# EAGLE design BeagleQ-v31 (EAGLE 7.1.0)
BOARD_NUMBER: 1.0
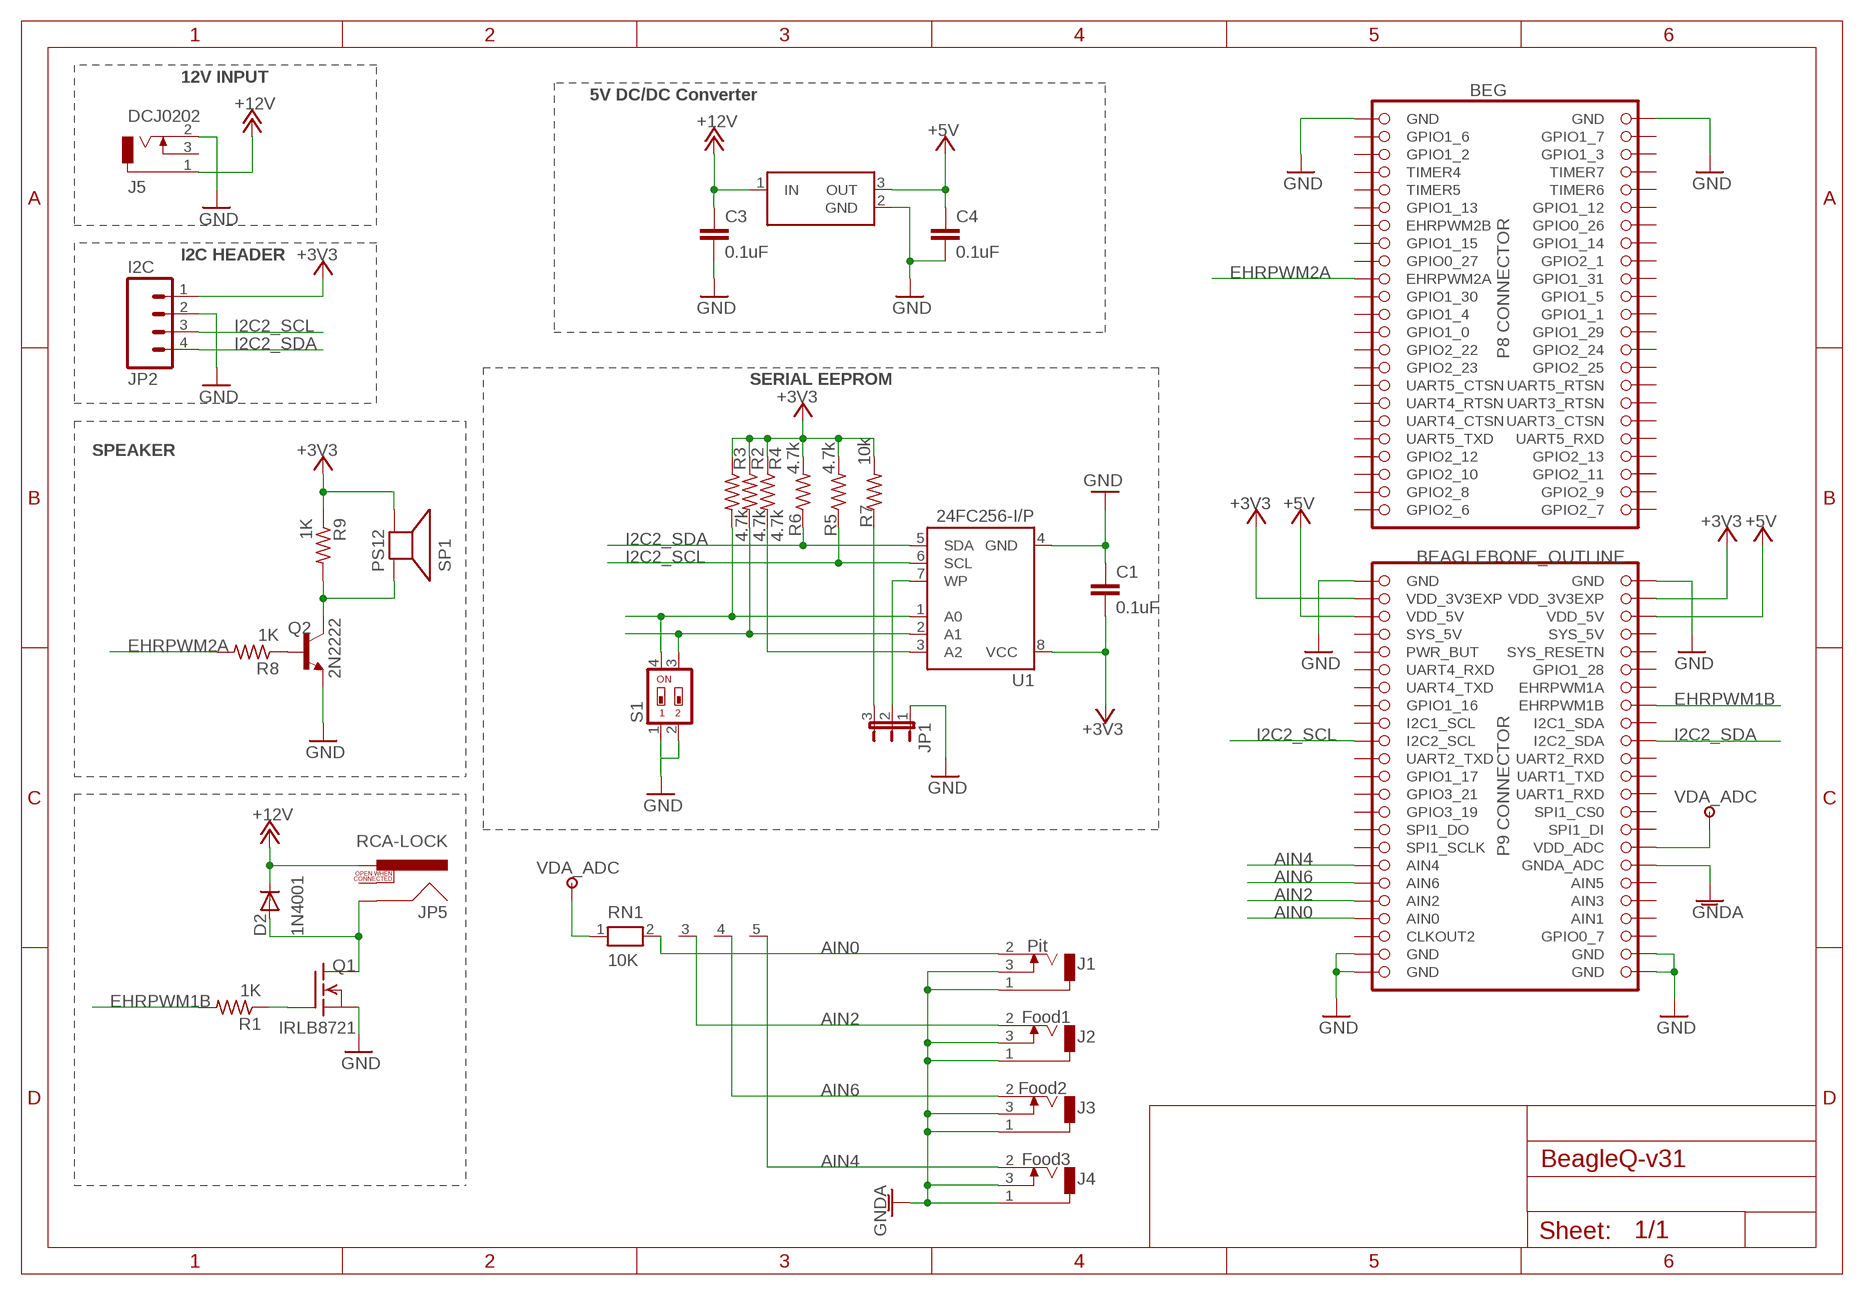
[diagram p0: schematic, sheet 1]

## Parts
BEG  BEAGLEBONE_OUTLINE  [BEAGLEBONE_SHIELD]
C1  0.1uF  C2.5/2  [C2.5-2]
C3  0.1uF  C2.5/2  [C2.5-2]
C4  0.1uF  C2.5/2  [C2.5-2]
D2  1N4001  1N4004  [DO41-10]
J1  Pit  MJ-2508N  [MJ-2508N]
J2  Food1  MJ-2508N  [MJ-2508N]
J3  Food2  MJ-2508N  [MJ-2508N]
J4  Food3  MJ-2508N  [MJ-2508N]
J5  DCJ0202  [DCJ0202]
JP1  WP  JP2E  [JP2]
JP2  I2C  M04PTH  [1X04]
JP5  RCA-LOCK  [RCA_LOCK]
Q1  IRLB8721  BUZ10  [TO220]
Q2  2N2222  [TO-92]
R1  1K  R-US_0207/10  [0207/10]
R2  4.7k  R-US_0207/10  [0207/10]
R3  4.7k  R-US_0207/10  [0207/10]
R4  4.7k  R-US_0207/10  [0207/10]
R5  4.7k  R-US_0207/10  [0207/10]
R6  4.7k  R-US_0207/10  [0207/10]
R7  10k  R-US_0207/10  [0207/10]
R8  1K  R-US_0207/10  [0207/10]
R9  1K  R-US_0207/10  [0207/10]
RN1  10K  RN04  [RN-5]
S1  SWS002  [SMS-002]
SP1  PS12  SPEAKER/PS12  [PS12]
U1  24FC256-I/P  AT24CP  [DIL08]
U2  OKI-78SRHZNTL  [OKI-78SR-HZNTL]

## Nets
+3V3: BEG.49(VDD_3V3EXP) BEG.50(VDD_3V3EXP) C1.2 JP2.1 R2.1 R3.1 R4.1 R5.2 R6.2 R7.2 R9.1 SP1.P$2(-) U1.8(VCC)
+5V [VDD]: BEG.51(VDD_5V) BEG.52(VDD_5V) C4.1 U2.3(OUT)
+12V: C3.1 D2.C J5.1 JP5.PIN U2.1(IN)
AIN0: BEG.85(AIN0) J1.2 RN1.2
AIN2: BEG.83(AIN2) J2.2 RN1.3
AIN4: BEG.79(AIN4) J4.2 RN1.5
AIN6: BEG.81(AIN6) J3.2 RN1.4
BLOWER_L [VCC_12V]: D2.A JP5.SHELL Q1.2(D)
EHRPWM1B: BEG.62(EHRPWM1B) R1.2
EHRPWM2A: BEG.19(EHRPWM2A) R8.2
GND [GND]: BEG.1(GND) BEG.2(GND) BEG.47(GND) BEG.48(GND) BEG.89(GND) BEG.90(GND) BEG.91(GND) BEG.92(GND) C1.1 C3.2 C4.2 J5.2 JP1.1 JP2.2 Q1.3(S) Q1.4(S) Q2.1(E) S1.1 S1.2 U1.4(GND) U2.2(GND)
GNDA: BEG.80(GNDA_ADC) J1.1 J1.3 J2.1 J2.3 J3.1 J3.3 J4.1 J4.3
I2C2_SCL: BEG.65(I2C2_SCL) JP2.3 R5.1 U1.6(SCL)
I2C2_SDA: BEG.66(I2C2_SDA) JP2.4 R6.1 U1.5(SDA)
N$1: R2.2 S1.3 U1.2(A1)
N$2: R3.2 S1.4 U1.1(A0)
N$3: JP1.2 U1.7(WP)
N$4: Q1.1(G) R1.1
N$5: JP1.3 R7.1
N$9: R4.2 U1.3(A2)
N$12: Q2.2(B) R8.1
N$13: Q2.3(C) R9.2 SP1.P$1(+)
VDA_ADC: BEG.78(VDD_ADC) RN1.1
Unconnected: BEG.3(GPIO1_6) BEG.4(GPIO1_7) BEG.5(GPIO1_2) BEG.6(GPIO1_3) BEG.7(TIMER4) BEG.8(TIMER7) BEG.9(TIMER5) BEG.10(TIMER6) BEG.11(GPIO1_13) BEG.12(GPIO1_12) BEG.13(EHRPWM2B) BEG.14(GPIO0_26) BEG.15(GPIO1_15) BEG.16(GPIO1_14) BEG.17(GPIO0_27) BEG.18(GPIO2_1) BEG.20(GPIO1_31) BEG.21(GPIO1_30) BEG.22(GPIO1_5) BEG.23(GPIO1_4) BEG.24(GPIO1_1) BEG.25(GPIO1_0) BEG.26(GPIO1_29) BEG.27(GPIO2_22) BEG.28(GPIO2_24) BEG.29(GPIO2_23) BEG.30(GPIO2_25) BEG.31(UART5_CTSN) BEG.32(UART5_RTSN) BEG.33(UART4_RTSN) BEG.34(UART3_RTSN) BEG.35(UART4_CTSN) BEG.36(UART3_CTSN) BEG.37(UART5_TXD) BEG.38(UART5_RXD) BEG.39(GPIO2_12) BEG.40(GPIO2_13) BEG.41(GPIO2_10) BEG.42(GPIO2_11) BEG.43(GPIO2_8) BEG.44(GPIO2_9) BEG.45(GPIO2_6) BEG.46(GPIO2_7) BEG.54(SYS_5V) BEG.55(PWR_BUT) BEG.56(SYS_RESETN) BEG.57(UART4_RXD) BEG.58(GPIO1_28) BEG.59(UART4_TXD) BEG.60(EHRPWM1A) BEG.61(GPIO1_16) BEG.63(I2C1_SCL) BEG.64(I2C1_SDA) BEG.67(UART2_TXD) BEG.68(UART2_RXD) BEG.69(GPIO1_17) BEG.70(UART1_TXD) BEG.71(GPIO3_21) BEG.72(UART1_RXD) BEG.73(GPIO3_19) BEG.74(SPI1_CS0) BEG.75(SPI1_DO) BEG.76(SPI1_DI) BEG.77(SPI1_SCLK) BEG.82(AIN5) BEG.84(AIN3) BEG.86(AIN1) BEG.87(CLKOUT2) BEG.88(GPIO0_7) J5.3 JP5.SWITCH

## Notes on the sheet
- 12V INPUT
- 5V DC/DC Converter
- I2C HEADER
- SERIAL EEPROM
- SPEAKER

## Power pins joined to a net without a drawn wire
SYS_5V: BEG.53(SYS_5V)

## Library data of the parts
BEG = BeagleQ-v03:BEAGLEBONE_OUTLINE: Should match A3 pinout - but not completely tested
C1 C3 C4 = capacitor-wima:C: CAPACITOR naming: grid - package width
D2 = BeagleQ-v03:1N4004: DIODE General purpose 1N400x type rectifier (With bigger pads) http://www.ladyada.net/library/pcb/eaglelibrary.html
J1-J4 = BeagleQ-v03:MJ-2508N
J5 = BeagleQ-v03:DCJ0202: DC POWER JACK Source: DCJ0202.pdf; OC_FARNELL: unknown; OC_NEWARK: unknown
JP1 = jumper:JP2E: JUMPER
JP2 = SparkFun-Connectors:M04: Header 4 Standard 4-pin 0.1" header. Use with straight break away headers (SKU : PRT-00116), right angle break away headers (PRT-00553), swiss pins (PRT-00743), machine pins (PRT-00117), and female headers (PRT-00115). Molex polarized connector foot print use with SKU : PRT-08231 with associated crimp pins and housings. 1MM SMD Version SKU: PRT-10208
JP5 = BeagleQ-v03:RCA
Q1 = BeagleQ-v03:BUZ10: N-Channel Enhancement MOSFET 50V; 20A; 0,080Ohm
Q2 = BeagleQ-v03:2N2222*: NPN Transistor
R1 R8 R9 = BeagleQ-v03:R-US_: RESISTOR, American symbol
R2-R7 = resistor:R-US_: RESISTOR, American symbol
RN1 = BeagleQ-v03:RN04: RESISTOR NETWORK; OC_FARNELL: unknown; OC_NEWARK: unknown
S1 = BeagleQ-v03:SWS002: SMD Dip Switch 2 pol.
SP1 = adafruit:SPEAKER: SPEAKER Source: Buerklin Added PS12 (for part # PS1240 piezo) http://www.ladyada.net/library/pcb/eaglelibrary.html
U1 = BeagleQ-v03:AT24C*: 2-wire serial EEPROM; MPN: AT24C1024BW-SH-B; OC_FARNELL: 1362646; OC_NEWARK: 03P2044
U2 = BeagleQ-v03:OKI-78SR

## Net classes
0 default: width 0.203 mm
1 VCC_12V: width 0.305 mm, drill 0.406 mm
2 VDD: width 0.305 mm, drill 0.406 mm
3 GND: width 0.254 mm, drill 0.406 mm

## Board
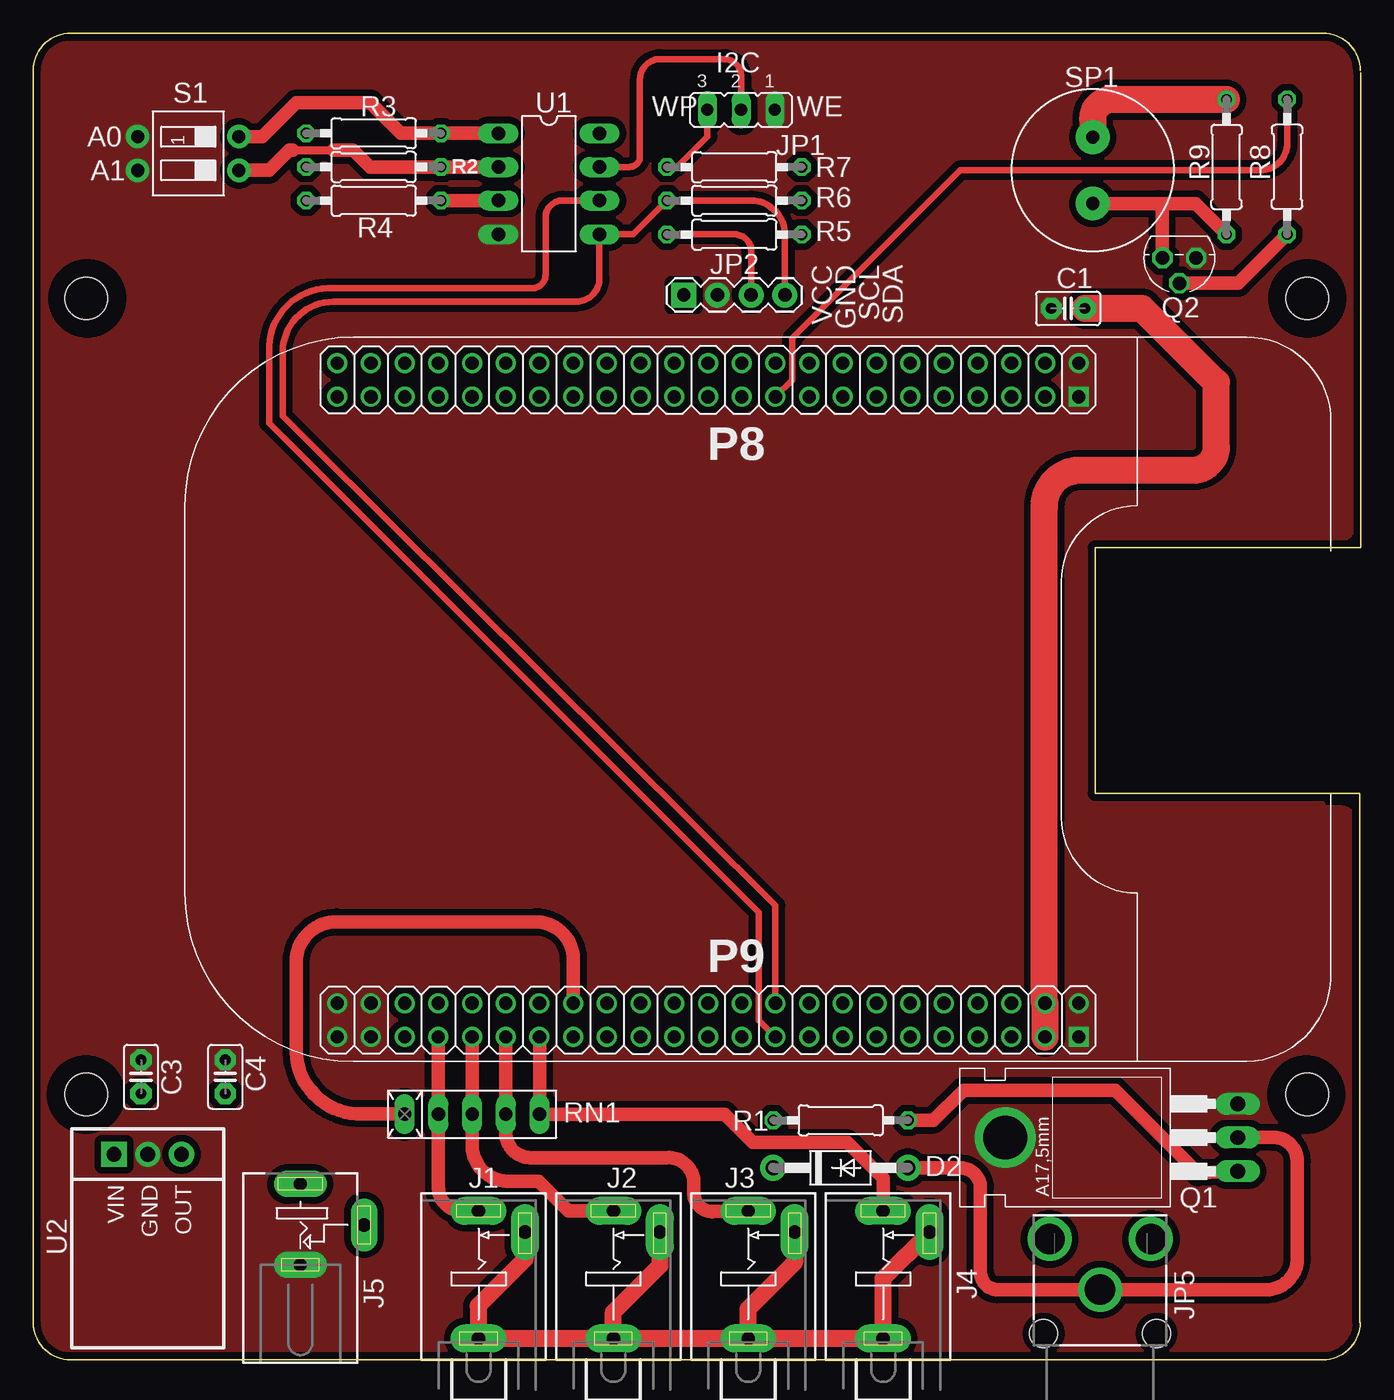
[diagram p1: board, top side]
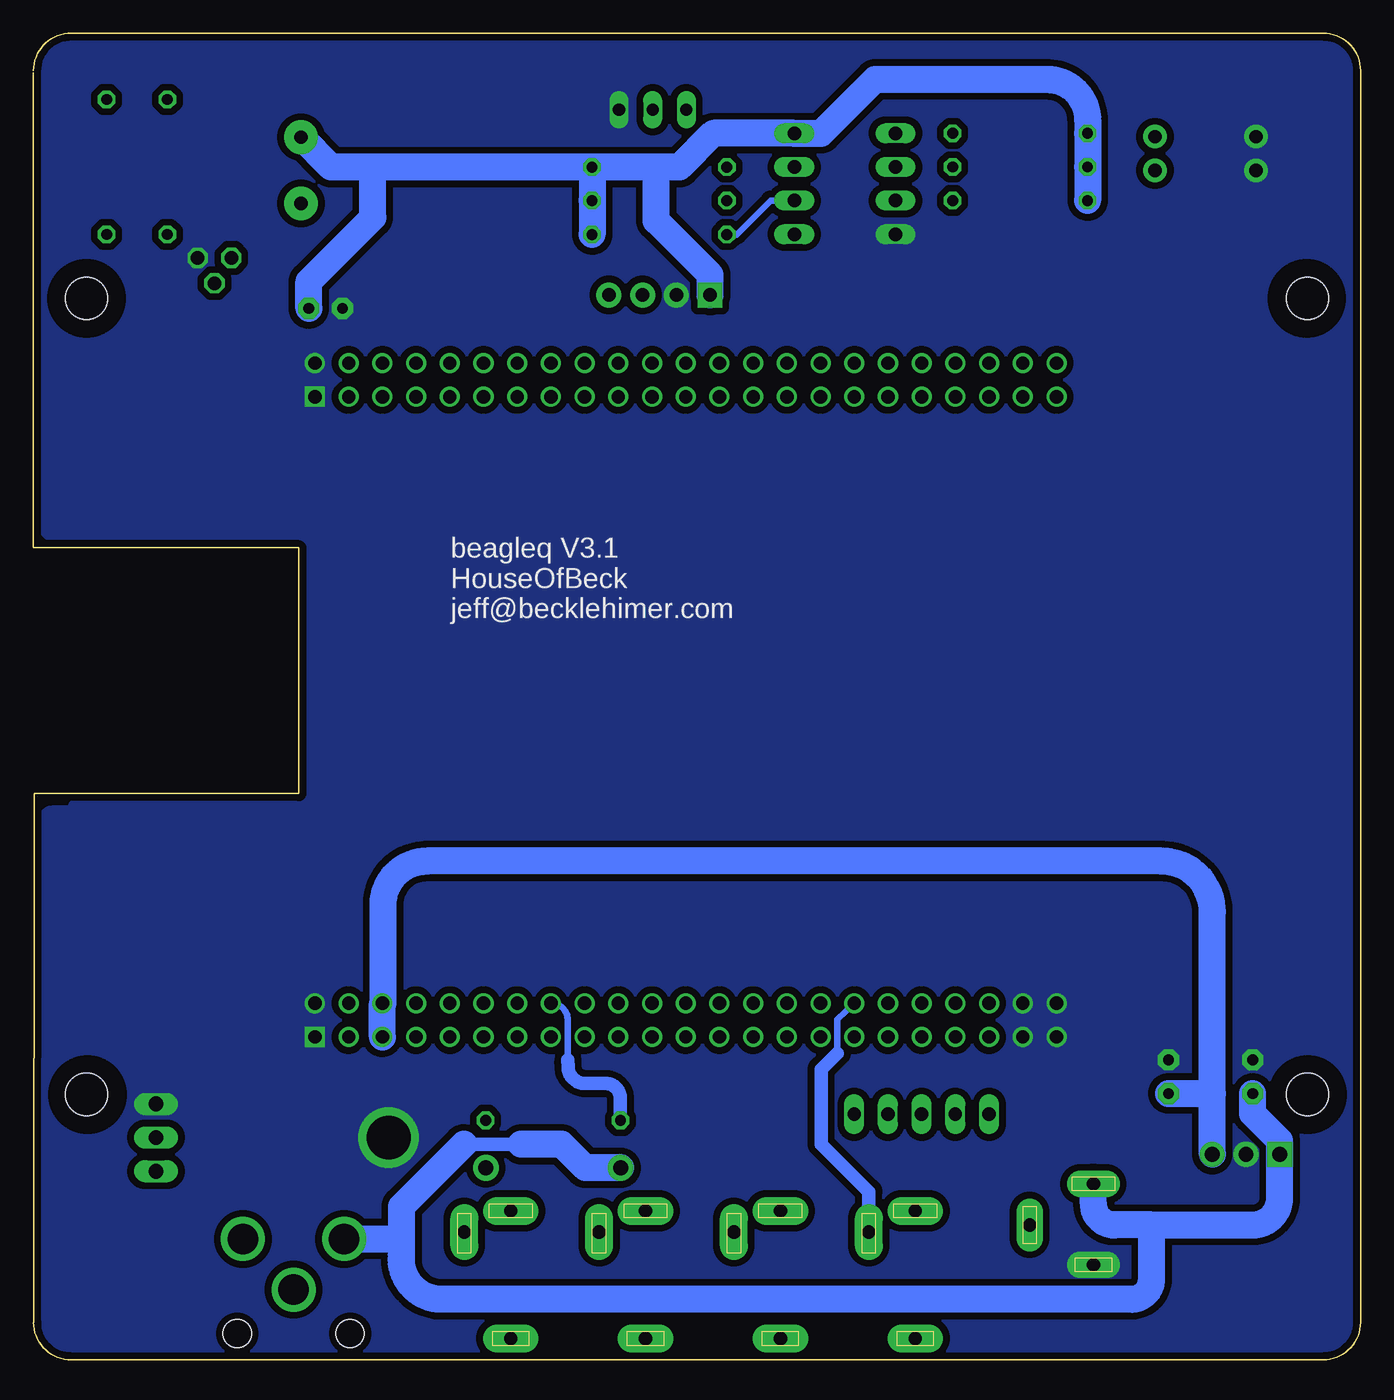
[diagram p2: board, bottom side, seen from below]

Size 100.02 x 100 mm. Coordinates in mm from the lower left corner, seen from the top.
Copper layers 1*16: Top 0.035mm / dielectric 1.5mm / Bottom 0.035mm
Design rules "dirt_cheap_dirty_boards.v1 *": minimum track width 5mil, minimum drill 12mil, track to track 10mil, track to pad 10mil, pad to pad 10mil, via to via 10mil, smd to smd 0mil, copper to edge 20mil, drill to drill 20mil, minimum pad ring 10mil, minimum via ring 6mil, stop-mask expansion 2mil, vias tented up to drill 25mil, thermal gap 10mil
tRestrict: area 93.8,77.8 to 98.2,82.2; area 1.9,77.8 to 6.2,82.2; area 1.8,17.8 to 6.2,22.2; area 93.8,17.8 to 98.1,22.2
bRestrict: area 93.8,77.8 to 98.2,82.2; area 1.9,77.8 to 6.2,82.2; area 1.8,17.8 to 6.2,22.2; area 93.8,17.8 to 98.1,22.2

### Footprints (pad centres in the part's own frame; a part is rotated, then mirrored left to right if it is on the bottom)
BEAGLEBONE_SHIELD = drill 1 square: 1 78.79,72.595; 47 78.79,24.335 | drill 1: 2 78.79,75.135; 3 76.25,72.595; 4 76.25,75.135; 5 73.71,72.595; 6 73.71,75.135; 7 71.17,72.595; 8 71.17,75.135; 9 68.63,72.595; 10 68.63,75.135; 11 66.09,72.595; 12 66.09,75.135; 13 63.55,72.595; 14 63.55,75.135; 15 61.01,72.595; 16 61.01,75.135; 17 58.47,72.595; 18 58.47,75.135; 19 55.93,72.595; 20 55.93,75.135; 21 53.39,72.595; 22 53.39,75.135; 23 50.85,72.595; 24 50.85,75.135; 25 48.31,72.595; 26 48.31,75.135; 27 45.77,72.595; 28 45.77,75.135; 29 43.23,72.595; 30 43.23,75.135; 31 40.69,72.595; 32 40.69,75.135; 33 38.15,72.595; 34 38.15,75.135; 35 35.61,72.595; 36 35.61,75.135; 37 33.07,72.595; 38 33.07,75.135; 39 30.53,72.595; 40 30.53,75.135; 41 27.99,72.595; 42 27.99,75.135; 43 25.45,72.595; 44 25.45,75.135; 45 22.91,72.595; 46 22.91,75.135; 48 78.79,26.875; 49 76.25,24.335; 50 76.25,26.875; 51 73.71,24.335; 52 73.71,26.875; 53 71.17,24.335; 54 71.17,26.875; 55 68.63,24.335; 56 68.63,26.875; 57 66.09,24.335; 58 66.09,26.875; 59 63.55,24.335; 60 63.55,26.875; 61 61.01,24.335; 62 61.01,26.875; 63 58.47,24.335; 64 58.47,26.875; 65 55.93,24.335; 66 55.93,26.875; 67 53.39,24.335; 68 53.39,26.875; 69 50.85,24.335; 70 50.85,26.875; 71 48.31,24.335; 72 48.31,26.875; 73 45.77,24.335; 74 45.77,26.875; 75 43.23,24.335; 76 43.23,26.875; 77 40.69,24.335; 78 40.69,26.875; 79 38.15,24.335; 80 38.15,26.875; 81 35.61,24.335; 82 35.61,26.875; 83 33.07,24.335; 84 33.07,26.875; 85 30.53,24.335; 86 30.53,26.875; 87 27.99,24.335; 88 27.99,26.875; 89 25.45,24.335; 90 25.45,26.875; 91 22.91,24.335; 92 22.91,26.875 | hole 3.2: 4,80; 96,80; 96,20; 4,20
C2.5-2 = drill 0.813 pad 1.6 octagon: 1 -1.27,0; 2 1.27,0
DO41-10 = drill 1.118 pad 1.93: A 5.08,0; C -5.08,0
MJ-2508N = drill 1 pad 2.1 long: 1 0,-6.52; 2 0,3.1; 3 3.5,1.5
DCJ0202 = drill 1 pad 2 long: 1 0,3.1; 2 0,-3; 3 4.8,0
JP2 = drill 0.914 long: 1 -2.54,0; 2 0,0; 3 2.54,0
1X04 = drill 1.016 pad 1.88 square: 1 0,0 | drill 1.016 pad 1.88: 2 2.54,0; 3 5.08,0; 4 7.62,0
RCA_LOCK = drill 2.3: PIN 4.03,3.802; SHELL 0.203,0; SWITCH 4.03,-3.827 | hole 2.134: -3.1,4.25; -3.1,-4.25
TO220 = drill 1.118 long: 1 -2.54,-6.35; 2 0,-6.35; 3 2.54,-6.35 | drill 3.302 pad 4.572: 4 0,11.176
TO-92 = drill 1.016 octagon: 1 -1.27,0; 2 0,1.905; 3 1.27,0
0207/10 = drill 0.813 octagon: 1 -5.08,0; 2 5.08,0
RN-5 = drill 1 long: 1 -5.08,0; 2 -2.54,0; 3 0,0; 4 2.54,0; 5 5.08,0
SMS-002 = drill 1 pad 1.778: 1 -1.27,-3.81; 2 1.27,-3.81; 3 1.27,3.81; 4 -1.27,3.81
PS12 = drill 1 pad 2.54: P$1 -2.5,0; P$2 2.5,0
DIL08 = drill 1.016 long: 1 -3.81,-3.81; 2 -1.27,-3.81; 3 1.27,-3.81; 4 3.81,-3.81; 5 3.81,3.81; 6 1.27,3.81; 7 -1.27,3.81; 8 -3.81,3.81
OKI-78SR-HZNTL = drill 1.118 pad 1.905 square: 1 2.54,0 | drill 1.118 pad 1.905: 2 0,0; 3 -2.54,0

### Placement (x,y rotation side)
BEG  0,0 0 top
C1  77.98,79.25 0 top
C3  8.13,21.34 90 top
C4  14.48,21.34 90 top
D2  60.83,14.47 0 top
J1  33.56,8.13 0 top
J2  43.72,8.13 0 top
J3  53.88,8.13 0 top
J4  64.04,8.13 0 top
J5  20.13,10.16 0 top
JP1  53.34,94.23 180 top
JP2  49.02,80.26 0 top
JP5  80.39,5.08 90 top
Q1  84.42,16.75 90 top
Q2  86.36,83.06 180 top
R1  60.85,18.05 180 top
R2  25.65,89.92 0 top
R3  25.65,92.46 0 top
R4  25.65,87.38 0 top
R5  52.83,84.82 0 top
R6  52.83,87.38 0 top
R7  52.83,89.9 0 top
R8  94.49,89.92 90 top
R9  89.92,89.92 270 top
RN1  33.08,18.51 0 top
S1  11.68,90.93 270 top
SP1  79.84,89.66 90 top
U1  38.86,88.65 270 top
U2  8.64,15.49 180 top

### Tracks (layer width: path | path; a pad name or v marks a point on that pad's centre or on a via)
+3V3
  Top 2.032: BEG.49 BEG.50 arc-90 76.2,26.93 76.2,64.26 arc-90 78.74,67.06 87.38,67.06 arc90 89.15,68.83 89.15,73.66 83.57,79.25 C1.2 | R9.1 81.28,95 arc90 79.84,93.55 SP1.P$2
  Bottom 2.032: R5.2 R6.2 R7.2 | 53.34,89.92 51.31,89.92 48.77,92.46 U1.8 40.64,92.46 36.58,96.52 23.62,96.52 arc90 20.57,93.47 R3.1 R2.1 R4.1 | 53.34,89.92 57.9,89.92 R7.2 | R7.2 arc-90 57.93,89.92 74.42,89.92 | 74.42,89.92 77.59,89.92 SP1.P$2 | C1.2 79.25,81.28 74.42,86.11 74.42,89.92 | JP2.1 49.02,81.79 53.09,85.85 53.09,89.66 53.34,89.92
+5V
  Bottom 2.032: BEG.51 BEG.52 arc-90 73.66,26.93 73.66,34.29 arc90 70.36,37.59 14.99,37.59 arc90 11.18,33.78 11.18,20.07 | U2.3 11.18,20.07 | C4.1 11.18,20.07
+12V
  Top 1.016: J5.1 arc90 20.19,13.32
  Bottom 1.016: 63.25,16.26 67.56,16.26
  Bottom 2.032: D2.C 58.41,14.47 60.2,16.26 63.25,16.26 | 67.56,16.26 72.26,11.56 72.26,8.89 | 15.75,10.16 18.54,10.16 arc90 20.13,11.75 J5.1 | 15.75,10.16 15.75,6.1 arc90 17.27,4.57 69.6,4.57 arc90 72.26,8 72.26,8.89 | JP5.PIN 72.48,9.11 72.26,8.89 | 15.75,10.16 8.13,10.16 arc-90 6.1,12.19 U2.1 6.1,16.51 8.13,18.54 C3.1
AIN0
  Top 0.508: BEG.85
  Top 1.016: BEG.85 RN1.2 30.54,12.98 arc90 32.29,11.23 J1.2
AIN2
  Top 0.508: BEG.83
  Top 1.016: BEG.83 RN1.3 33.08,16.33 arc90 35.69,13.46 38.1,13.46 40.33,11.23 J2.2
AIN4
  Top 0.508: BEG.79
  Top 1.016: BEG.79 RN1.5 52.1,18.51 54.23,16.38 61.34,16.38 64.04,13.68 J4.2
AIN6
  Top 0.508: BEG.81
  Top 1.016: BEG.81 RN1.4 35.62,17.09 arc90 37.47,15.24 47.75,15.24 arc-90 49.78,13.46 49.78,12.45 arc90 51.31,11.18 53.83,11.18 arc90 J3.2
BLOWER_L
  Top 1.016: D2.A 69.86,14.47 arc-90 71.37,12.95 71.37,6.6 arc90 72.69,5.28 JP5.SHELL 92.91,5.28 arc90 95.25,7.62 95.25,14.99 arc90 93.47,16.76 90.78,16.76 Q1.2
EHRPWM1B
  Bottom 0.508: 59.74,22.61 59.74,25.63 arc-90 BEG.62
  Bottom 1.016: 59.74,22.61 59.72,22.1 arc-90 58.45,20.83 56.9,20.83 arc90 55.77,19.7 R1.2
EHRPWM2A
  Top 0.508: R8.2 94.49,91.69 arc-90 92.46,89.66 69.85,89.66 57.2,77.01 57.2,73.87 BEG.19
GND
  pour Top (isolate 0.508, no thermals): 3.05,99.57 96.52,99.57 96.77,99.57 arc-90 99.57,96.77 99.57,62.99 arc-90 98.3,61.72 80.26,61.72 arc90 79.5,60.96 79.5,42.93 arc90 80.26,42.16 96.77,42.16 arc-90 97.28,41.66 98.55,41.66 arc-90 99.57,40.64 99.57,2.79 arc-90 97.28,0.51 3.05,0.51 arc-90 0.51,3.05 0.51,97.03 arc-90
  pour Bottom (isolate 0.508, no thermals): 3.05,99.57 96.77,99.57 arc-90 99.57,96.77 99.57,62.99 arc-90 98.3,61.72 80.26,61.72 arc90 79.5,60.96 79.5,42.93 arc90 80.26,42.16 96.77,42.16 arc-90 97.28,41.66 98.55,41.66 arc-90 99.57,40.64 99.57,2.79 arc-90 97.28,0.51 3.05,0.51 arc-90 0.51,3.05 0.51,97.03 arc-90
GNDA
  Top 1.27: J2.1 J1.1 33.53,1.64 33.53,4.06 37.06,7.6 J1.3 | J2.1 J3.1 | J3.1 J4.1 64.04,6.13 J4.3 | J2.1 43.72,3.59 47.24,7.11 47.24,9.6 J2.3 | J3.1 53.88,3.84 57.38,7.34 J3.3
  Bottom 0.508: 39.42,23.11 39.42,25.66 BEG.80
  Bottom 1.016: 33.53,1.64 J1.1 | J1.3 37.06,12.68 40.64,16.26 40.64,21.89 39.42,23.11
I2C2_SCL
  Top 0.508: BEG.65 54.66,25.6 54.66,33.73 17.78,70.61 17.78,76.45 arc-90 22.61,80.77 37.59,80.77 arc90 38.61,81.79 38.61,86.11 arc-90 39.88,87.38 U1.6 | R5.1 arc-90 47.77,84.84 52.83,84.84 arc-90 54.1,83.57 JP2.3
  Bottom 0.508: R5.1 47.01,84.82 44.45,87.38 U1.6
I2C2_SDA
  Top 0.508: BEG.66 55.93,34.24 20.83,69.09 18.8,71.12 18.8,75.95 arc-90 22.61,79.76 40.89,79.76 arc90 42.67,81.53 U1.5 45.21,84.84 R6.1 54.1,87.38 arc-90 56.64,84.84 JP2.4
N$1
  Top 0.61: 19.56,91.19 22.61,91.19
  Top 1.016: U1.2 R2.2 25.4,89.92 24.13,91.19 22.61,91.19 | S1.3 17.78,89.66 19.3,91.19 19.56,91.19
N$2
  Top 1.016: S1.4 17.27,92.2 19.81,94.74 25.4,94.74 27.69,92.46 R3.2 U1.1
N$3
  Top 0.508: U1.7 44.96,89.92 arc90 45.72,90.68 45.72,96.52 arc-90 47.24,98.04 52.07,98.04 arc-90 53.34,96.77 JP1.2
N$4
  Top 1.016: R1.1 67.83,18.05 70.1,20.32 81.53,20.32 87.77,14.09 Q1.1
N$5
  Top 0.508: R7.1 48.5,89.9 50.8,92.2 JP1.3
N$9
  Top 1.016: U1.3 R4.2
N$12
  Top 1.016: Q2.2 90.81,81.15 R8.1
N$13
  Top 1.016: SP1.P$1 84.84,87.16 | 84.84,87.16 87.59,87.16 R9.2 | Q2.3 85.09,86.91 84.84,87.16
VDA_ADC
  Top 1.016: RN1.1 arc90 27.96,18.54 24.38,18.54 arc-90 19.81,23.62 19.81,29.97 arc-90 22.86,33.02 37.85,33.02 arc-90 40.69,30.18 BEG.78

### Text on the board
tPlace: I2C | WP | WE | A0 | A1 | VCC | GND | SCL | SDA
bPlace: beagleq V3.1 / HouseOfBeck / jeff@becklehimer.com